# EAGLE design AAA_source (EAGLE 7.2.0)
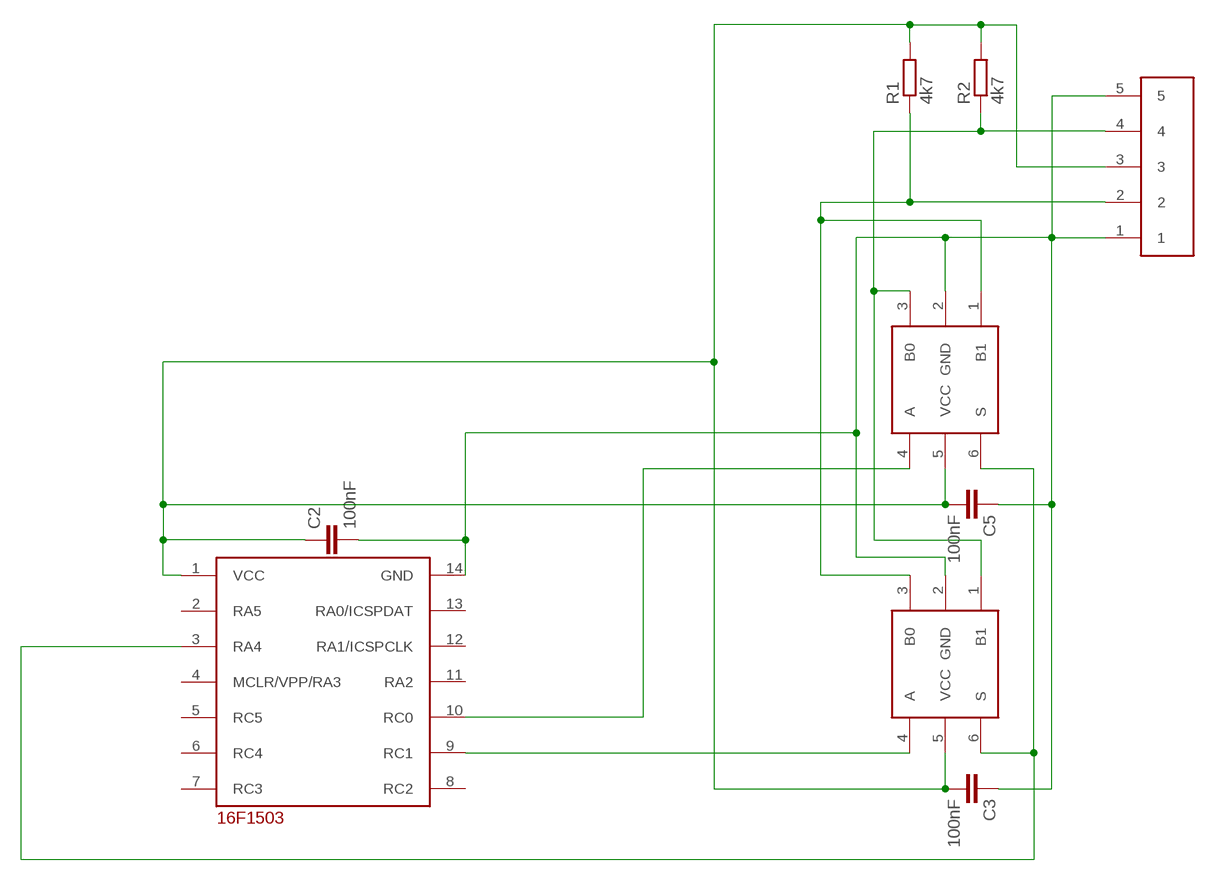
[diagram p0: schematic, sheet 1]

## Parts
C2  100nF  C-EUC0603  [C0603]
C3  100nF  C-EUC0603  [C0603]
C5  100nF  C-EUC0603  [C0603]
R1  4k7  R-EU_R0603  [R0603]
R2  4k7  R-EU_R0603  [R0603]
U$1  16F103-TSSOP  [TSSOP14]
U$5  JUMPER5F-90  [JUMPER5F-90]
U$6  NC7SB3157P6X  [SC70-6L]
U$7  NC7SB3157P6X  [SC70-6L]

## Nets
GND: C2.2 C3.1 C5.1 U$1.14(GND) U$5.1 U$5.5 U$6.2(GND) U$7.2(GND)
N$1: U$1.3(RA4) U$6.6(S) U$7.6(S)
N$4: U$1.9(RC1) U$7.4(A)
N$6: R1.1 U$5.2 U$6.1(B1) U$7.3(B0)
N$7: U$1.10(RC0) U$6.4(A)
N$10: R2.1 U$5.4 U$6.3(B0) U$7.1(B1)
VCC: C2.1 C3.2 C5.2 R1.2 R2.2 U$1.1(VCC) U$5.3 U$6.5(VCC) U$7.5(VCC)
Unconnected: U$1.2(RA5) U$1.4(MCLR/VPP/RA3) U$1.5(RC5) U$1.6(RC4) U$1.7(RC3) U$1.8(RC2) U$1.11(RA2) U$1.12(RA1/ICSPCLK) U$1.13(RA0/ICSPDAT)

## Library data of the parts
C2 C3 C5 = resistor:C-EU: CAPACITOR, European symbol
R1 R2 = resistor:R-EU_: RESISTOR, European symbol
U$1 = !stavebnice03:16F103-TSSOP
U$5 = !stavebnice03:JUMPER5F-90
U$6 U$7 = !stavebnice03:NC7SB3157P6X

## Board
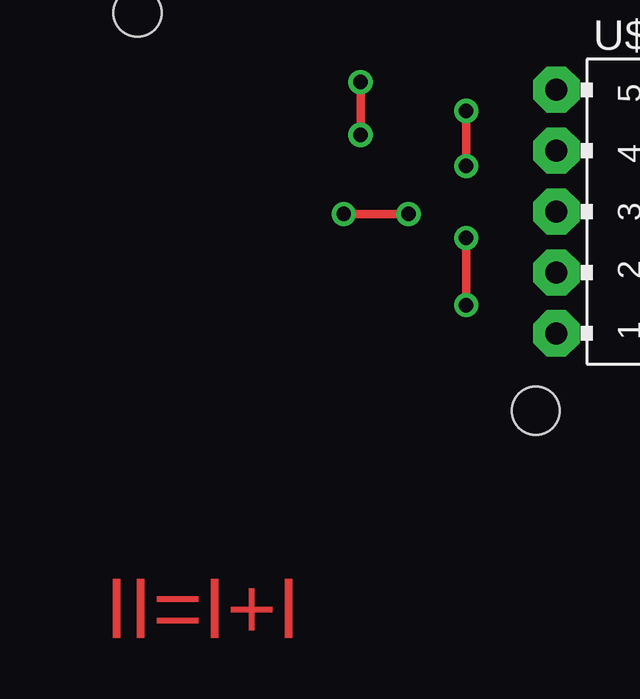
[diagram p1: board, top side]
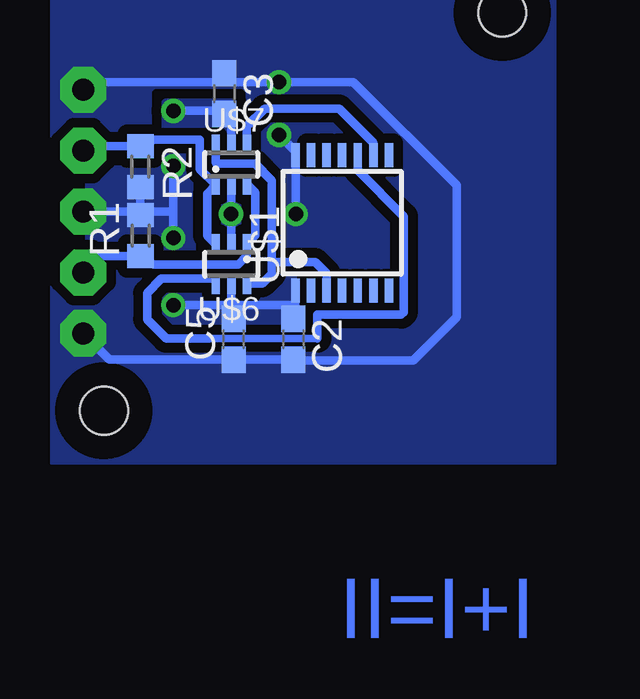
[diagram p2: board, bottom side, seen from below]

No outline drawn. Coordinates in mm, seen from the top.
Copper layers (1*16): Top 0.035mm / dielectric 1.5mm / Bottom 0.035mm
Design rules "default": minimum track width 10mil, minimum drill 24mil, track to track 8mil, track to pad 8mil, pad to pad 8mil, via to via 8mil, smd to smd 8mil, copper to edge 40mil, drill to drill 8mil, minimum pad ring 10mil, minimum via ring 8mil, stop-mask expansion 4mil, vias tented up to drill 0mil, thermal gap 10mil
Holes 2 mm at 2.2,18.8 18.8,2.2

### Footprints (pad centres in the part's own frame; a part is rotated, then mirrored left to right if it is on the bottom)
C0603 = smd 1.1 x 1: 1 -0.85,0; 2 0.85,0
R0603 = smd 1 x 1.1: 1 -0.85,0; 2 0.85,0
TSSOP14 = smd 0.35 x 1: 1 -1.95,-2.825; 2 -1.3,-2.825; 3 -0.65,-2.825; 4 0,-2.825; 5 0.65,-2.825; 6 1.3,-2.825; 7 1.95,-2.825; 8 1.95,2.825; 9 1.3,2.825; 10 0.65,2.825; 11 0,2.825; 12 -0.65,2.825; 13 -1.3,2.825; 14 -1.95,2.825
JUMPER5F-90 = drill 0.914 pad 1.93 octagon: 1 5.08,-2.54; 2 2.54,-2.54; 3 0,-2.54; 4 -2.54,-2.54; 5 -5.08,-2.54
SC70-6L = smd 0.35 x 0.8: 1 -0.65,-0.85; 2 0,-0.85; 3 0.65,-0.85; 4 0.65,0.85; 5 0,0.85; 6 -0.65,0.85

### Placement (x,y rotation side)
C2  10.9,5.18 270 bottom
C3  13.77,15.42 270 bottom
C5  13.39,5.18 90 bottom
R1  17.26,9.5 90 bottom
R2  17.28,12.37 270 bottom
U$1  8.87,10.04 0 bottom
U$5  22.2,10.5 270 top
U$6  13.49,8.31 180 bottom
U$7  13.49,12.46 0 bottom

### Tracks (layer width: path | path; a pad name or v marks a point on that pad's centre or on a via)
GND  (via drill 0.6)
  Top 0.357: v11.5,13.7 v11.5,15.9 | v13.5,10.4 v10.8,10.4
  Bottom 0.357: C3.1 13.67,16.27 13.6,15.9 | U$7.2 13.49,9.51 v13.5,10.4 13.49,9.49 U$6.2 | v11.5,13.7 10.8,13 v10.8,10.4 | 13.6,15.9 v11.5,15.9 8.4,15.9 4.1,11.6 4.1,6.1 5.9,4.3 10.87,4.3 C2.2 C5.1 18.57,4.33 U$5.1 | 13.6,15.9 19.34,15.9 U$5.5
  pour Bottom (isolate 0.406, rank 2, no thermals): 0,0 0,44 21,44 21,0
N$1
  Bottom 0.357: U$7.6 14.14,12.54 14.1,12.5 12.5,12.5 11.8,11.8 11.8,8.4 | 12.6,7.5 U$6.6 12.79,7.5 12.2,7.5 11.8,7.9 11.8,8.4 | U$1.3 9.52,7.92 10,8.4 11.8,8.4
N$4
  Bottom 0.357: U$7.4 12.84,14.06 12.1,14.8 9,14.8 7.57,13.37 U$1.9
N$6
  Bottom 0.357: U$7.3 12.81,11.62 12.5,11.3 12.5,9.49 U$6.1 12.84,8.66 13.2,8.3 16.71,8.3 R1.1 18.97,8.65 U$5.2
N$7
  Bottom 0.305: 9.9,5.2 14.4,5.2
  Bottom 0.357: U$6.4 14.14,7.7 16.4,7.7 17,7.1 17,6 16.2,5.2 14.4,5.2 | U$1.10 8.22,12.22 6.3,10.3 6.3,6.3 6.4,6.2 9.9,6.2 9.9,5.2
N$10
  Bottom 0.357: U$6.3 14.14,9.14 14.5,9.5 14.5,11.25 U$7.1 14.8,12.28 14.8,13.5 16.68,13.5 R2.1 19.48,13.22 U$5.4
VCC  (via drill 0.6)
  Top 0.357: v15.9,14.7 v15.9,12.4 | v15.9,9.4 v15.9,6.6
  Bottom 0.357: U$7.5 13.49,14.53 C3.2 13.65,14.7 v15.9,14.7 | 13.41,6.4 C5.2 13.5,6.34 13.5,6.6 | U$5.3 17.3,10.5 | 17.26,10.46 17.2,10.4 | R2.2 17.28,10.42 17.2,10.4 | 17.2,10.4 17.26,10.34 R1.2 17.26,10.46 | 17.18,10.52 17.2,10.5 | 17.26,10.46 17.3,10.5 | 17.3,10.5 15.9,10.5 | 15.9,10.5 v15.9,12.4 | 15.9,10.5 v15.9,9.4 | 10.82,5.95 C2.1 10.82,6.11 10.82,6.6 | 10.82,6.6 13.5,6.6 | 13.5,6.6 v15.9,6.6 | U$6.5 13.49,6.81 13.5,6.6 | U$1.1 10.82,6.6
  pour Bottom (isolate 0.406, no thermals): 19.4,13 19.4,8 14.4,8 14.4,13.5 19.3,13.5
  pour Bottom (isolate 0.406, no thermals): 9.6,8 16.3,8 16.3,5.4 9.6,5.4
  pour Bottom (isolate 0.305, no thermals): 13.5,15 16.2,15 16.2,13.9 13.5,13.9

### Text on the board
Top: II=I+I
Bottom: II=I+I
Dimension: AAA source